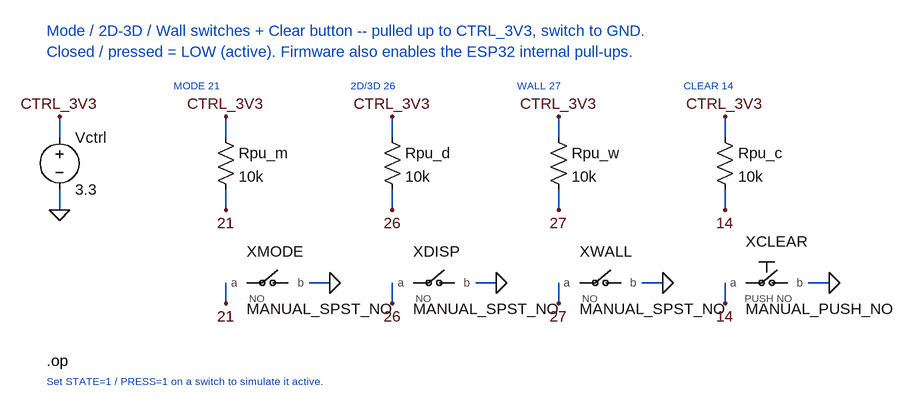
[diagram p0: schematic switches.asc]
switches.asc, the LTspice schematic file:
Version 4
SHEET 1 1300 760
WIRE -240 -16 -240 16
WIRE -240 96 -240 128
WIRE 16 -16 16 16
WIRE 16 96 16 128
WIRE 16 240 16 272
WIRE 144 240 176 240
WIRE 272 -16 272 16
WIRE 272 96 272 128
WIRE 272 240 272 272
WIRE 400 240 432 240
WIRE 528 -16 528 16
WIRE 528 96 528 128
WIRE 528 240 528 272
WIRE 656 240 688 240
WIRE 784 -16 784 16
WIRE 784 96 784 128
WIRE 784 240 784 272
WIRE 912 240 944 240
FLAG -240 -16 CTRL_3V3
FLAG -240 128 0
FLAG 16 -16 CTRL_3V3
FLAG 16 128 21
FLAG 16 272 21
FLAG 176 240 0
FLAG 272 -16 CTRL_3V3
FLAG 272 128 26
FLAG 272 272 26
FLAG 432 240 0
FLAG 528 -16 CTRL_3V3
FLAG 528 128 27
FLAG 528 272 27
FLAG 688 240 0
FLAG 784 -16 CTRL_3V3
FLAG 784 128 14
FLAG 784 272 14
FLAG 944 240 0
SYMBOL voltage -240 0 R0
WINDOW 123 0 0 Left 0
WINDOW 39 0 0 Left 0
SYMATTR InstName Vctrl
SYMATTR Value 3.3
SYMBOL res 0 0 R0
SYMATTR InstName Rpu_m
SYMATTR Value 10k
SYMBOL MANUAL_SPST_NO 80 240 R0
SYMATTR InstName XMODE
SYMATTR SpiceLine STATE=0
SYMBOL res 256 0 R0
SYMATTR InstName Rpu_d
SYMATTR Value 10k
SYMBOL MANUAL_SPST_NO 336 240 R0
SYMATTR InstName XDISP
SYMATTR SpiceLine STATE=0
SYMBOL res 512 0 R0
SYMATTR InstName Rpu_w
SYMATTR Value 10k
SYMBOL MANUAL_SPST_NO 592 240 R0
SYMATTR InstName XWALL
SYMATTR SpiceLine STATE=0
SYMBOL res 768 0 R0
SYMATTR InstName Rpu_c
SYMATTR Value 10k
SYMBOL MANUAL_PUSH_NO 848 232 R0
SYMATTR InstName XCLEAR
SYMATTR SpiceLine PRESS=0
TEXT -64 -64 Left 1 ;MODE 21
TEXT 208 -64 Left 1 ;2D/3D 26
TEXT 464 -64 Left 1 ;WALL 27
TEXT 720 -64 Left 1 ;CLEAR 14
TEXT -260 -148 Left 2 ;Mode / 2D-3D / Wall switches + Clear button -- pulled up to CTRL_3V3, switch to GND.
TEXT -260 -116 Left 2 ;Closed / pressed = LOW (active). Firmware also enables the ESP32 internal pull-ups.
TEXT -260 360 Left 2 !.op
TEXT -260 392 Left 1 ;Set STATE=1 / PRESS=1 on a switch to simulate it active.

The netlist it stands for:
* switches.asc
Vctrl CTRL_3V3 0 3.3
Rpu_m CTRL_3V3 21 10k
XXMODE 21 0 MANUAL_SPST_NO STATE=0  ; pins a b
Rpu_d CTRL_3V3 26 10k
XXDISP 26 0 MANUAL_SPST_NO STATE=0  ; pins a b
Rpu_w CTRL_3V3 27 10k
XXWALL 27 0 MANUAL_SPST_NO STATE=0  ; pins a b
Rpu_c CTRL_3V3 14 10k
XXCLEAR 14 0 MANUAL_PUSH_NO PRESS=0  ; pins a b
* MODE 21
* 2D/3D 26
* WALL 27
* CLEAR 14
* Mode / 2D-3D / Wall switches + Clear button -- pulled up to CTRL_3V3, switch to GND.
* Closed / pressed = LOW (active). Firmware also enables the ESP32 internal pull-ups.
.op
* Set STATE=1 / PRESS=1 on a switch to simulate it active.
.lib ManualSwitch.lib
.backanno
.end